# Altium schematic sheet Bus_Connections.SCHDOC: Bus-Wire Interconnect Example
size A; Organization: Altium Limited; Address1: L3, 12a Rodborough Rd; Address2: Frenchs Forest; Address3: NSW; Address4: Australia 2086; DocumentNumber: 1; SheetNumber: 1; SheetTotal: 1
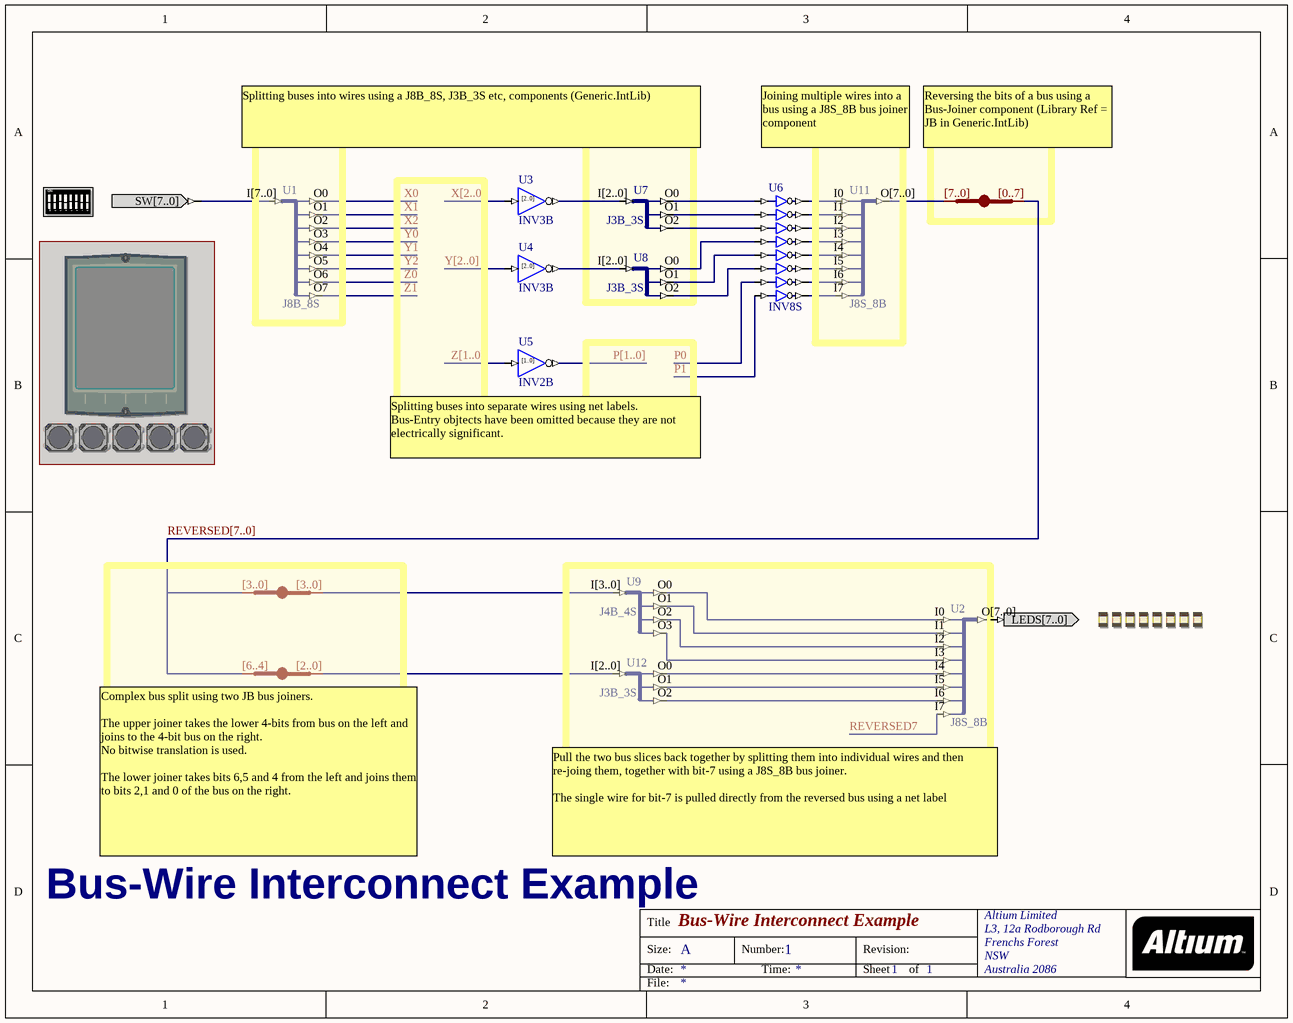
[diagram p0: Bus_Connections.SCHDOC]

## Parts
(Parts that share a designator on the sheet are numbered #1, #2 ... from top to bottom, then left to right.)
?#1  DIPSWITCH  (value not drawn)
?#2  FIRMWARE_TFT_ENABLE  (value not drawn)  (masked out: inside a compile mask, not in the netlist)
?#3  FIRMWARE_BUTTONS_ENABLE  (value not drawn)  (masked out: inside a compile mask, not in the netlist)
?#4  LED  (value not drawn)
JB_AUTO1  IndexA: [3..0]  (hidden comment: JB)
JB_AUTO2  IndexA: [6..4]  IndexB: [2..0]  (hidden comment: JB)
JB_AUTO3  IndexA: [7..0]  IndexB: [0..7]  (hidden comment: JB)
U1  J8B_8S
U2  J8S_8B
U3  INV3B
U4  INV3B
U5  INV2B
U6  INV8S
U7  J3B_3S
U8  J3B_3S
U9  J4B_4S
U11  J8S_8B
U12  J3B_3S

## Nets
P0: U6.I6
P1: U6.I7
P[1..0]: U5.O[1..0]
REVERSED7: U2.I7
REVERSED[7..0]: JB_AUTO1.A[0..0] JB_AUTO2.A[0..0] JB_AUTO3.B[0..0]
X0: U1.O0
X1: U1.O1
X2: U1.O2
X[2..0]: U3.I[2..0]
Y0: U1.O3
Y1: U1.O4
Y2: U1.O5
Y[2..0]: U4.I[2..0]
Z0: U1.O6
Z1: U1.O7
Z[1..0]: U5.I[1..0]
Net?#1_SW[7..0]: ?#1.SW[7..0] U1.I[7..0]
Net?#4_LEDS[7..0]: ?#4.LEDS[7..0] U2.O[7..0]
NetJB_AUTO1_B[0..0]: JB_AUTO1.B[0..0] U9.I[3..0]
NetJB_AUTO2_B[0..0]: JB_AUTO2.B[0..0] U12.I[2..0]
NetJB_AUTO3_A[0..0]: JB_AUTO3.A[0..0] U11.O[7..0]
NetU2_I0: U2.I0 U9.O0
NetU2_I1: U2.I1 U9.O1
NetU2_I2: U2.I2 U9.O2
NetU2_I3: U2.I3 U9.O3
NetU2_I4: U2.I4 U12.O0
NetU2_I5: U2.I5 U12.O1
NetU2_I6: U2.I6 U12.O2
NetU3_O[2..0]: U3.O[2..0] U7.I[2..0]
NetU4_O[2..0]: U4.O[2..0] U8.I[2..0]
NetU6_I0: U6.I0 U7.O0
NetU6_I1: U6.I1 U7.O1
NetU6_I2: U6.I2 U7.O2
NetU6_I3: U6.I3 U8.O0
NetU6_I4: U6.I4 U8.O1
NetU6_I5: U6.I5 U8.O2
NetU6_O0: U6.O0 U11.I0
NetU6_O1: U6.O1 U11.I1
NetU6_O2: U6.O2 U11.I2
NetU6_O3: U6.O3 U11.I3
NetU6_O4: U6.O4 U11.I4
NetU6_O5: U6.O5 U11.I5
NetU6_O6: U6.O6 U11.I6
NetU6_O7: U6.O7 U11.I7

## Buses and harness runs
bus P[1..0]
bus REVERSED[7..0]
bus X[2..0]
bus Y[2..0]
bus Z[1..0]

## Notes on the sheet
- Splitting buses into wires using a J8B_8S, J3B_3S etc, components (Generic.IntLib)
- Joining multiple wires into a bus using a J8S_8B bus joiner component
- Reversing the bits of a bus using a Bus-Joiner component (Library Ref = JB in Generic.IntLib)
- (near U5) Splitting buses into separate wires using net labels.
  Bus-Entry objtects have been omitted because they are not electrically significant.
- Bus-Wire Interconnect Example
- (near JB_AUTO2) Complex bus split using two JB bus joiners.
  The upper joiner takes the lower 4-bits from bus on the left and joins to the 4-bit bus on the right.
  No bitwise translation is used.
  The lower joiner takes bits 6,5 and 4 from the left and joins them to bits 2,1 and 0 of the bus on the right.
- Pull the two bus slices back together by splitting them into individual wires and then re-joing them, together with bit-7 using a J8S_8B bus joiner.
  The single wire for bit-7 is pulled directly from the reversed bus using a net label
- Title
- Size:
- Date:
- A
- Number:
- Time:
- Revision:
- Sheet
- of
- File:
- (in symbol DIPSWITCH) ON; 1; 2; 3; 4; 5; 6; 7; 8
- (in symbol INV2B) [1..0]
- (in symbol INV3B) [2..0]

## Library data of the parts
?#1 = DIPSWITCH: 8-Way Dip-Switch; PortComponent: True; Published: 19-Nov-2003; Publisher: Altium Limited; HelpURL: TR0143 Technical Reference Manual for Altium's Desktop NanoBoard NB2DSK01.pdf#page=51
?#2 = FIRMWARE_TFT_ENABLE: TFT LCD Panel; PortComponent: True; Published: 22-Jan-2007; Publisher: Altium Limited; HelpURL: TR0143 Technical Reference Manual for Altium's Desktop NanoBoard NB2DSK01.pdf#page=50
?#3 = FIRMWARE_BUTTONS_ENABLE: Generic User Buttons; PortComponent: True; Published: 16-Apr-2007; Publisher: Altium Limited; HelpURL: TR0143 Technical Reference Manual for Altium's Desktop NanoBoard NB2DSK01.pdf#page=53
?#4 = LED: Bank of eight Red LEDs; PortComponent: True; Published: 19-Nov-2003; Publisher: Altium Limited; HelpURL: TR0143 Technical Reference Manual for Altium's Desktop NanoBoard NB2DSK01.pdf#page=51
JB_AUTO1-JB_AUTO3 = JB: System BUS Joiner; ArchiveName: GENERIC; Published: 18-Dec-2003; Publisher: Altium Limited; Core Revision: 1.00.00
  JB_AUTO1: IndexB: [3..0]
U1 = J8B_8S: 8-Bit input bus to 8 single pin outputs; ArchiveName: GENERIC; Published: 18-Dec-2003; Publisher: Altium Limited; Core Revision: 1.00.00
U2 U11 = J8S_8B: 8 Single pin inputs to single 8-Bit output bus; ArchiveName: GENERIC; Published: 18-Dec-2003; Publisher: Altium Limited; Core Revision: 1.00.00
U3 U4 = INV3B: 3-Bit Inverter, Bus Version; ArchiveName: GENERIC; Published: 18-Dec-2003; Publisher: Altium Limited; Core Revision: 1.00.00
U5 = INV2B: 2-Bit Inverter, Bus Version; ArchiveName: GENERIC; Published: 18-Dec-2003; Publisher: Altium Limited; Core Revision: 1.00.00
U6 = INV8S: 8-Bit Inverter, Single Pin Version; ArchiveName: GENERIC; Published: 18-Dec-2003; Publisher: Altium Limited; Core Revision: 1.00.00
U7 U8 U12 = J3B_3S: 3-Bit input bus to 3 Single pin outputs; ArchiveName: GENERIC; Published: 18-Dec-2003; Publisher: Altium Limited; Core Revision: 1.00.00
U9 = J4B_4S: 4-Bit input bus to 4 Single pin outputs; ArchiveName: GENERIC; Published: 18-Dec-2003; Publisher: Altium Limited; Core Revision: 1.00.00